# Altium schematic sheet 05_Motor.SchDoc
size A4
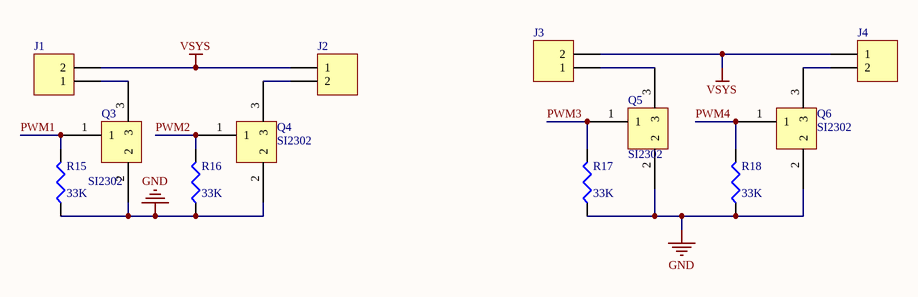
[diagram p0: 05_Motor.SchDoc]

## Parts
J1  Header 2  [HDR1X2]  (value not drawn)
J2  Header 2  [HDR1X2]  (value not drawn)
J3  Header 2  [HDR1X2]  (value not drawn)
J4  Header 2  [HDR1X2]  (value not drawn)
Q3  SI2302  [SOT-23_M]
Q4  SI2302  [SOT-23_M]
Q5  SI2302  [SOT-23_M]
Q6  SI2302  [SOT-23_M]
R15  value 33K  [0402]  (hidden comment: Res3)
R16  value 33K  [0402]  (hidden comment: Res3)
R17  value 33K  [0402]  (hidden comment: Res3)
R18  value 33K  [0402]  (hidden comment: Res3)

## Nets
GND: Q3.2 Q4.2 Q5.2 Q6.2 R15.1 R16.1 R17.1 R18.1
VSYS: J1.2 J2.1 J3.2 J4.1
PWM1: Q3.1 R15.2
PWM2: Q4.1 R16.2
PWM3: Q5.1 R17.2
PWM4: Q6.1 R18.2
NetJ1_1: J1.1 Q3.3
NetJ2_2: J2.2 Q4.3
NetJ3_1: J3.1 Q5.3
NetJ4_2: J4.2 Q6.3

## Library data of the parts
J1-J4 = Header 2: Header, 2-Pin; LatestRevisionDate: 17-Jul-2002; LatestRevisionNote: Re-released for DXP Platform.; Publisher: Altium Limited
R15-R18 = Res3: Resistor; Published: 8-Jun-2000; LatestRevisionDate: 29-May-2009; LatestRevisionNote: IPC-7351 Footprint Added.; PackageReference: J1-0603; Publisher: Altium Limited; PackageDescription: Chip Resistor